# Altium schematic sheet 5V_Regulator.SchDoc
size Letter; SheetNumber: 3; SheetTotal: 13
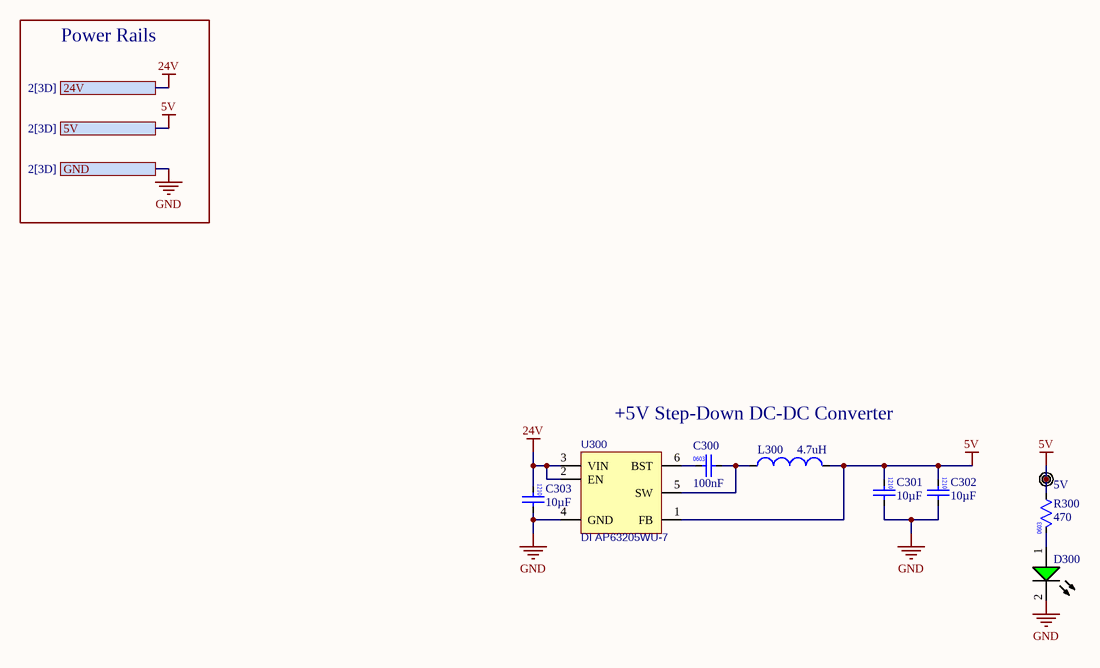
[diagram p0: 5V_Regulator.SchDoc]

## Parts
C300  value 100nF  [0603 Capacitor Footprint]  (hidden comment: 0603 0.1uF 5% 50V)
C301  value 10µF  [1210 CAPACTIOR (TDK C-SERIES)]  (hidden comment: 1210 10uF 10% 50V)
C302  value 10µF  [1210 CAPACTIOR (TDK C-SERIES)]  (hidden comment: 1210 10uF 10% 50V)
C303  value 10µF  [1210 CAPACTIOR (TDK C-SERIES)]  (hidden comment: 1210 10uF 10% 50V)
D300  Lite-On LTST-C193KGKT-5A  [Lite-On LTST-C193KGKT-5A GREEN (1608)]  (value not drawn)
L300  Inductance: 4.7uH  [BOURNS SRN6045-4R7Y]  (hidden comment: Bourns SRN6045-4R7Y)
R300  value 470  [0603 Resistor Footprint]  (hidden comment: 0603 470R 5% 0.25W)
TP300  5V  [TESTPOINT]  (no BOM)
U300  DI AP63205WU-7  [Diodes Incorporated AP63205WU-7]

## Ports
5V (see 2[3D]), 24V (see 2[3D]), GND (see 2[3D])

## Nets
5V: C301.2 C302.2 L300.2 R300.1 TP300.1(TP) U300.1(FB) ; port 5V
24V: C303.2 U300.2(EN) U300.3(VIN) ; port 24V
GND: C301.1 C302.1 C303.1 D300.2(K) U300.4(GND) ; port GND
NetC300_1: C300.1 L300.1 U300.5(SW)
NetC300_2: C300.2 U300.6(BST)
NetD300_1: D300.1(A) R300.2

## Notes on the sheet
- Power Rails
- +5V Step-Down DC-DC Converter

## Library data of the parts
C300 = CMP-001-00091-5: CAP CER 0.1UF 50V X7R 0603; Manufacturer Part Number: CC0603JPX7R9BB104; Capacitor Type: Ceramic; Case/Package: 0603; Tolerance: 5%; Voltage Rating: 50V; Mounting Technology: SF
C301-C303 = CMP-001-00098-1: Ceramic Capacitor, Multilayer, Ceramic, 50V, 10% Tol, X7R, 15% TC, 10uF, Surface Mount, 1210; Capacitor Type: Ceramic; Min Operating Temperature: -55°C; Source: UBC Formula Electric.SchLib; Mounting Technology: Surface Mount; Case/Package: 1210; Pins: 2; Voltage Rating: 50V; Tolerance: 10%; Design Item ID: 1210 Generic Ceramic Capacitor; RoHS Compliant: Yes; Max Operating Temperature: 125°C
D300 = CMP-026-000009-1: LED GREEN CLEAR CHIP SMD; Source: UBC Formula Electric.SchLib; Supplier 1: Digi-Key; Supplier Part Number 1: 160-1828-1-ND; Design Item ID: Lite-On LTST-C193KGKT-5A
L300 = CMP-032-000001-1: FIXED IND 4.7UH 3A 37.6 MOHM SMD; Supplier Part Number 1: SRN6045-4R7YCT-ND; Supplier 1: Digi-Key; Source: UBC Formula Electric.SchLib; Design Item ID: Bourns SRN6045-4R7Y
R300 = CMP-009-00193-4: Res Thick Film 0603 470 Ohm 5% 0.25W(1/4W) ±200ppm/C Pad SMD Automotive T/R; Manufacturer Part Number: ERJ-PA3J471V; Power: 250mW; Tolerance: 5%; Max Operating Temperature: 155°C; Digikey Part Number: P470BZCT-ND; Case/Package: 0603; Mounting Technology: Surface Mount; Pins: 2; RoHS Compliant: Yes; Min Operating Temperature: -55°C
TP300 = CMP-020-0000-4: Design Item ID: Thru-Hole Test Point; Source: UBC Formula Electric.SchLib
U300 = CMP-025-000004-2: IC REG BUCK 5V 2A TSOT26; Design Item ID: DI AP63205WU-7